# EAGLE design as5050-dev-board (EAGLE 9.6.2)
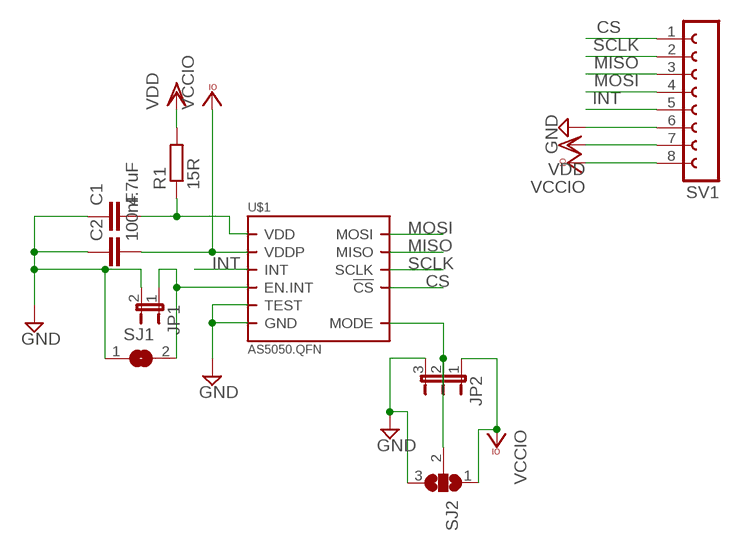
[diagram p0: schematic, sheet 1]

## Parts
C1  4.7uF  C-EUC0805  [C0805]
C2  100nF  C-EUC0805  [C0805]
JP1  JP1E  [JP1]
JP2  JP2E  [JP2]
R1  15R  R-EU_R0805  [R0805]
SJ1  SJ  [SJ]
SJ2  SJ2W  [SJ_2]
SV1  FE08-1  [FE08]
U$1  AS5050.QFN  [QFN.16]

## Nets
CS: SV1.1 U$1.4(!CS)
GND: C1.1 C2.1 JP1.2 JP2.3 SJ1.1 SJ2.3 SV1.6 U$1.9(TEST) U$1.13(GND)
INT: SV1.5 U$1.15(INT)
MISO: SV1.3 U$1.2(MISO)
MOSI: SV1.4 U$1.1(MOSI)
N$1: JP2.2 SJ2.2 U$1.14(MODE)
N$2: C1.2 R1.1 U$1.12(VDD)
N$3: JP1.1 SJ1.2 U$1.10(EN.INT)
SCLK: SV1.2 U$1.3(SCLK)
VCCIO: C2.2 JP2.1 SJ2.1 SV1.8 U$1.11(VDDP)
VDD: R1.2 SV1.7

## Library data of the parts
C1 C2 = rcl:C-EU: CAPACITOR, European symbol; SPICEPREFIX: C
JP1 = jumper:JP1E: JUMPER
JP2 = jumper:JP2E: JUMPER
R1 = rcl:R-EU_: RESISTOR, European symbol; SPICEPREFIX: R
SJ1 = jumper:SJ: SMD solder JUMPER
SJ2 = jumper:SJ2W: SMD solder JUMPER
SV1 = con-lsta:FE08-1: FEMALE HEADER; OC_FARNELL: unknown; OC_NEWARK: unknown
U$1 = AS5050:AS5050: Check prices <https://pricing.snapeda.com/parts/AS5050/ams/view-part?ref=eda>; AVAILABILITY: In Stock; DESCRIPTION: Hall Effect Sensor Rotary Position External Magnet, Not Included SMD (SMT) Tab; MF: ams; MP: AS5050; PACKAGE: QFN-16 ams; PRICE: None; PURCHASE-URL: https://pricing.snapeda.com/search/part/AS5050/?ref=eda

## Board
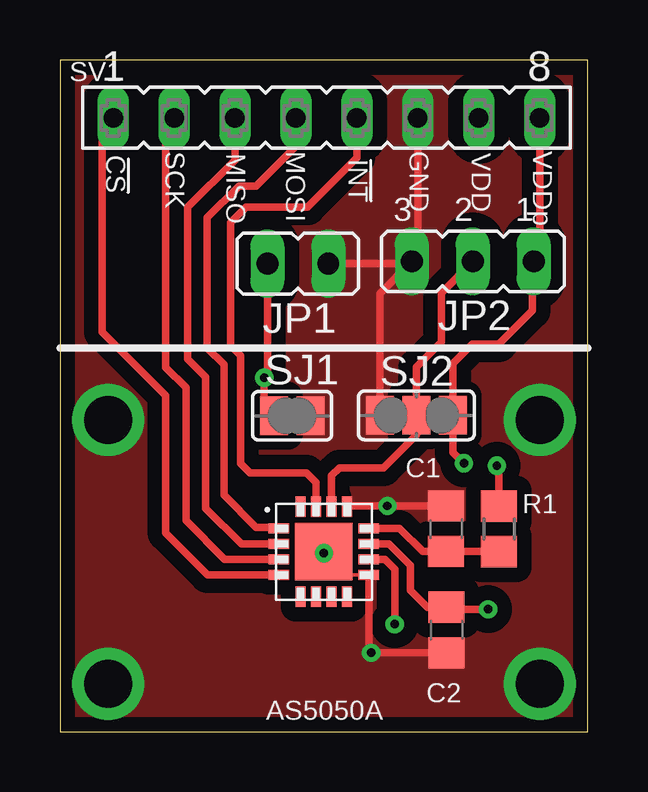
[diagram p1: board, top side]
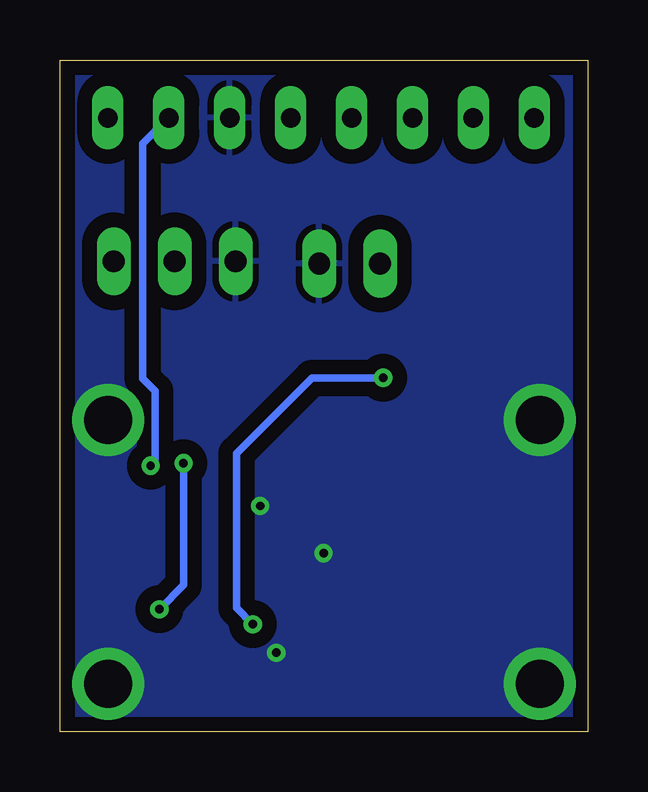
[diagram p2: board, bottom side, seen from below]

Size 22 x 28 mm. Coordinates in mm from the lower left corner, seen from the top.
Outline: 0,0 22,0 22,28 0,28 0,0
Copper layers (1*16): Top 0.035mm / dielectric 1.5mm / Bottom 0.035mm
Design rules "default *": minimum track width 6mil, minimum drill 0.35mm, track to track 6mil, track to pad 6mil, pad to pad 6mil, via to via 6mil, smd to smd 6mil, copper to edge 6mil, drill to drill 6mil, minimum pad ring 10mil, minimum via ring 8mil, stop-mask expansion 4mil, vias tented up to drill 0mil, thermal gap 10mil

### Footprints (pad centres in the part's own frame; a part is rotated, then mirrored left to right if it is on the bottom)
C0805 = smd 1.3 x 1.5: 1 -0.95,0; 2 0.95,0
JP1 = drill 0.914 long: 1 0,-1.27; 2 0,1.27
JP2 = drill 0.914 long: 1 -2.54,0; 2 0,0; 3 2.54,0
R0805 = smd 1.3 x 1.5: 1 -0.95,0; 2 0.95,0
SJ = smd 1.168 x 1.6: 1 -0.762,0; 2 0.762,0
SJ_2 = smd 1.168 x 1.6: 1 -1.524,0; 2 0,0; 3 1.524,0
FE08 = drill 0.813 long: 1 -8.89,0; 2 -6.35,0; 3 -3.81,0; 4 -1.27,0; 5 1.27,0; 6 3.81,0; 7 6.35,0; 8 8.89,0
QFN.16 = smd 0.85 x 0.42: 1 -1.875,0.975; 2 -1.875,0.325; 3 -1.875,-0.325; 4 -1.875,-0.975; 9 1.875,-0.975; 10 1.875,-0.325; 11 1.875,0.325; 12 1.875,0.975 | smd 0.42 x 0.85: 5 -0.975,-1.875; 6 -0.325,-1.875; 7 0.325,-1.875; 8 0.975,-1.875; 13 0.975,1.875; 14 0.325,1.875; 15 -0.325,1.875; 16 -0.975,1.875 | smd 2.4 x 2.4: PAD 0,0

### Placement (x,y rotation side)
C1  16.1,8.46 270 top
C2  16.12,4.23 90 top
JP1  9.92,19.51 270 top
JP2  17.22,19.6 180 top
R1  18.31,8.45 90 top
SJ1  9.68,13.17 180 top
SJ2  14.86,13.18 180 top
SV1  11.11,25.59 0 top
U$1  11,7.5 0 top

### Tracks (layer width: path | path; a pad name or v marks a point on that pad's centre or on a via)
CS
  Top 0.305: U$1.4 6.17,6.53 4.4,8.29 4.4,14.02 1.75,16.66 1.75,25.12 SV1.1
GND  (via drill 0.35, 2 pad 2.6)
  Top 0.152: v11.01,7.43 11.91,6.53 U$1.9
  Top 0.305: SJ2.3 13.34,18.27 JP2.3 14.68,19.74 | C1.1 v13.65,9.4 12.01,9.4 U$1.13 | U$1.9 12.88,3.39 v12.98,3.28 C2.1 | SV1.6 14.92,19.98 14.68,19.74 | JP1.2 14.45,19.51 14.68,19.74
  other vias: 2,13 2,2 20,2 20,13
  pour Top (isolate 0.61, no thermals): 0.13,27.83 21.86,27.83 21.89,27.8 21.89,0.15 0.23,0.15 0.2,0.2 0.2,27.73 0.12,27.8
  pour Bottom (isolate 0.61): 0.1,27.83 21.82,27.83 21.86,27.8 21.86,0.15 0.2,0.15 0.17,0.2 0.17,27.73 0.1,27.8
INT
  Top 0.305: SV1.5 12.38,23.93 10.32,21.86 7.76,21.86 7.12,21.22 7.12,16.09 7.53,15.68 7.53,11.18 7.94,10.78 10.28,10.78 10.68,10.38 U$1.15
MISO
  Top 0.305: SV1.3 7.3,23.83 5.33,21.86 5.33,15.54 6.08,14.78 6.08,9.31 7.57,7.83 U$1.2
MOSI
  Top 0.305: U$1.1 9.09,8.51 8.18,8.51 6.84,9.86 6.84,15.29 6.15,15.99 6.15,21.42 7.47,22.75 8.18,22.75 9.84,24.41 SV1.4
N$1
  Top 0.305: U$1.14 11.32,10.67 11.65,10.99 13.49,10.99 14.86,12.37 14.86,12.96 SJ2.2 14.86,15.2 15.9,16.24 15.9,18.29 JP2.2
N$2
  Top 0.305: U$1.12 14.17,8.47 15.14,7.5 C1.2 R1.1
N$3  (via drill 0.35)
  Top 0.305: JP1.1 8.65,14.88 v8.52,14.75 8.52,13.57 SJ1.2 | U$1.10 13.54,7.17 13.96,6.76 v13.96,4.47
  Bottom 0.305: v13.96,4.47 14.63,5.15 14.63,11.59 11.48,14.75 v8.52,14.75
SCLK
  Top 0.305: SV1.2 4.41,25.24 4.41,15.18 5.25,14.34 5.25,8.79 6.87,7.17 U$1.3
VCCIO  (via drill 0.35)
  Top 0.305: JP2.1 19.7,19.55 19.7,19.38 | 19.7,19.38 19.7,17.55 18.3,16.15 17.19,16.15 16.39,15.34 SJ2.1 16.39,11.63 16.84,11.18 v16.85,11.19 | U$1.11 13.71,7.83 14.61,6.92 14.61,5.89 15.32,5.18 C2.2 16.21,5.1 v17.85,5.1 | SV1.8 20,19.68 19.7,19.38
  Bottom 0.305: v16.85,11.19 16.85,6.11 v17.85,5.1
VDD  (via drill 0.35)
  Top 0.305: v18.22,11.08 18.3,10.99 R1.2
  Bottom 0.305: SV1.7 18.54,24.51 18.54,14.72 18.03,14.21 18.03,11.27 v18.22,11.08

### Text on the board
tNames: CS | SCK | INT | GND | VDD | MISO | MOSI | VDDp | AS5050A